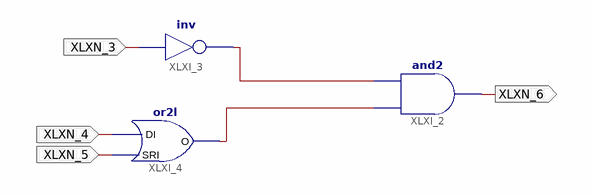
[diagram p0: schematic sheet 1]
// Xilinx ISE schematic first_schematic.sch (artix7) as structural Verilog: 3 symbols, 4 ports
module first_schematic (
  input  XLXN_3,
  input  XLXN_4,
  input  XLXN_5,
  output XLXN_6
);

  wire XLXN_1, XLXN_2;

  not XLXI_3 (XLXN_1, XLXN_3);
  or2l XLXI_4 (.O(XLXN_2), .SRI(XLXN_5), .DI(XLXN_4));
  and XLXI_2 (XLXN_6, XLXN_2, XLXN_1);
endmodule
